# EAGLE design miniboard_1 (EAGLE 9.6.2)
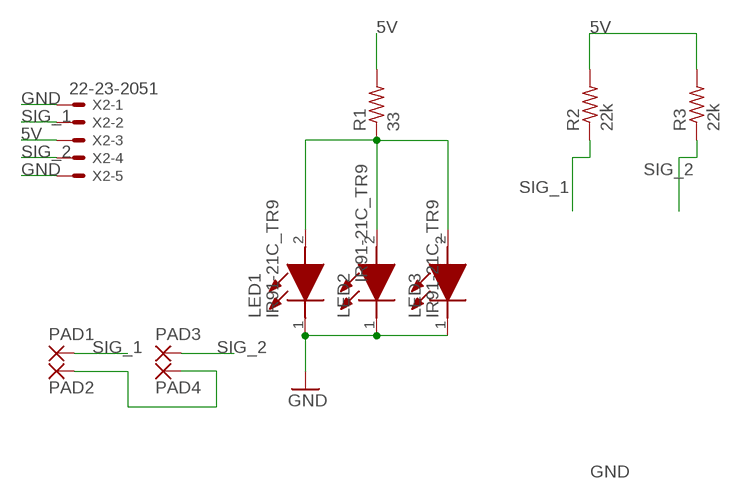
[diagram p0: schematic, sheet 1]

## Parts
LED1  IR91-21C_TR9  [SODFL7422X280N]
LED2  IR91-21C_TR9  [SODFL7422X280N]
LED3  IR91-21C_TR9  [SODFL7422X280N]
PAD1  SMD2  [SMD1,27-2,54]
PAD2  SMD2  [SMD1,27-2,54]
PAD3  SMD2  [SMD1,27-2,54]
PAD4  SMD2  [SMD1,27-2,54]
R1  33  R-US_0204/5  [0204/5]
R2  22k  R-US_0204/5  [0204/5]
R3  22k  R-US_0204/5  [0204/5]
X2  22-23-2051  [22-23-2051]

## Nets
5V: R1.2 R2.2 R3.2 X2.3
GND: LED1.1(K) LED2.1(K) LED3.1(K) PAD2.1(P) PAD4.1(P) X2.1 X2.5
N$1: LED1.2(A) LED2.2(A) LED3.2(A) R1.1
SIG_1: PAD1.1(P) R2.1 X2.2
SIG_2: PAD3.1(P) R3.1 X2.4

## Library data of the parts
LED1-LED3 = IR91-21C_TR9:IR91-21C_TR9: Infrared Emitters Infrared LED Source: Datasheet <https://www.digikey.ca/en/products/detail/everlight-electronics-co-ltd/IR91-21C-TR9/2675854>; DESCRIPTION: Infrared Emitters Infrared LED; HEIGHT: 2.8mm; MANUFACTURER_NAME: Everlight; MANUFACTURER_PART_NUMBER: IR91-21C/TR9
PAD1-PAD4 = wirepad:SMD2: SMD PAD
R1-R3 = adafruit:R-US_: RESISTOR, American symbol
X2 = con-molex:22-23-2051: .100" (2.54mm) Center Header - 5 Pin; MF: MOLEX; MPN: 22-23-2051; OC_FARNELL: 1462952; OC_NEWARK: 38C9178

## Board
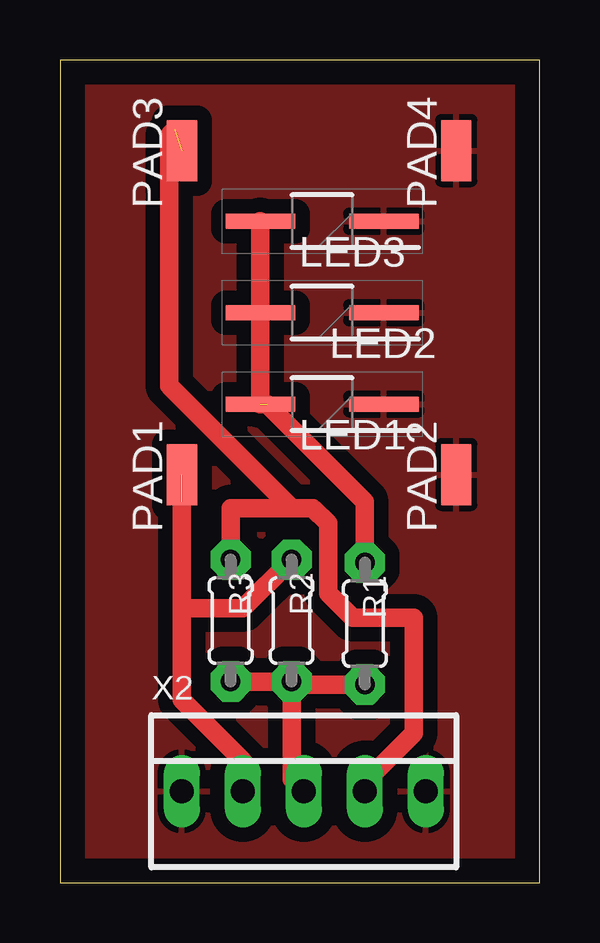
[diagram p1: board, top side]

Size 19.99 x 34.28 mm. Coordinates in mm from the lower left corner, seen from the top.
Outline: 0,0 19.99,0 19.99,34.28 0,34.28 0,0
Copper layers (1*16): Top 0.035mm / dielectric 1.5mm / Bottom 0.035mm
Design rules "default": minimum track width 6mil, minimum drill 0.35mm, track to track 6mil, track to pad 6mil, pad to pad 6mil, via to via 6mil, smd to smd 6mil, copper to edge 40mil, drill to drill 6mil, minimum pad ring 10mil, minimum via ring 8mil, stop-mask expansion 4mil, vias tented up to drill 0mil, thermal gap 10mil

### Footprints (pad centres in the part's own frame; a part is rotated, then mirrored left to right if it is on the bottom)
SODFL7422X280N = smd 2.89 x 0.63: 1 -2.575,0; 2 2.575,0
SMD1,27-2,54 = smd 1.27 x 2.54: 1 0,0
0204/5 = drill 0.813 pad 1.676 octagon: 1 -2.54,0; 2 2.54,0
22-23-2051 = drill 1 long: 1 -5.08,0; 2 -2.54,0; 3 0,0; 4 2.54,0; 5 5.08,0

### Placement (x,y rotation side)
LED1  10.92,19.94 180 top
LED2  10.92,23.75 180 top
LED3  10.92,27.56 180 top
PAD1  5.08,17 0 top
PAD2  16.51,17 0 top
PAD3  5.08,30.5 0 top
PAD4  16.51,30.5 0 top
R1  12.7,10.79 270 top
R2  9.65,10.92 270 top
R3  7.11,10.92 270 top
X2  10.16,3.81 0 top

### Tracks (layer width: path | path; a pad name or v marks a point on that pad's centre or on a via)
5V
  Top 0.254: 9.78,8.26 R2.2
  Top 0.762: R3.2 R2.2 9.65,4.32 X2.3 | R1.2 9.78,8.26
GND
  pour Top (isolate 0.61, rank 6): 0,34.29 0,0 20.32,0 20.32,34.29
N$1  (1 unrouted)
  Top 0.762: R1.1 12.7,15.88 8.64,19.94 | LED1.2 LED2.2 LED3.2
SIG_1  (1 unrouted)
  Top 0.152: 7.62,3.94 X2.2
  Top 0.762: X2.2 7.62,5.08 5.08,7.62 5.08,11.43 | 5.08,11.43 5.08,15.88 | R2.1 7.62,11.43 5.08,11.43
SIG_2  (1 unrouted)
  Top 0.152: R3.1 7.11,13.7
  Top 0.762: 4.79,31.37 4.55,31.14 4.55,20.7 9.65,15.61 | R3.1 7.11,15.61 9.65,15.61 | X2.4 12.7,4.19 14.73,6.22 14.73,11.05 12.19,11.05 11.18,12.06 11.18,14.97 10.54,15.61 9.65,15.61